# Altium schematic sheet OPA41971.V03.R00.SchDoc: Conversión a DAC Bipolar
size A4; SheetNumber: 12; SheetTotal: 18
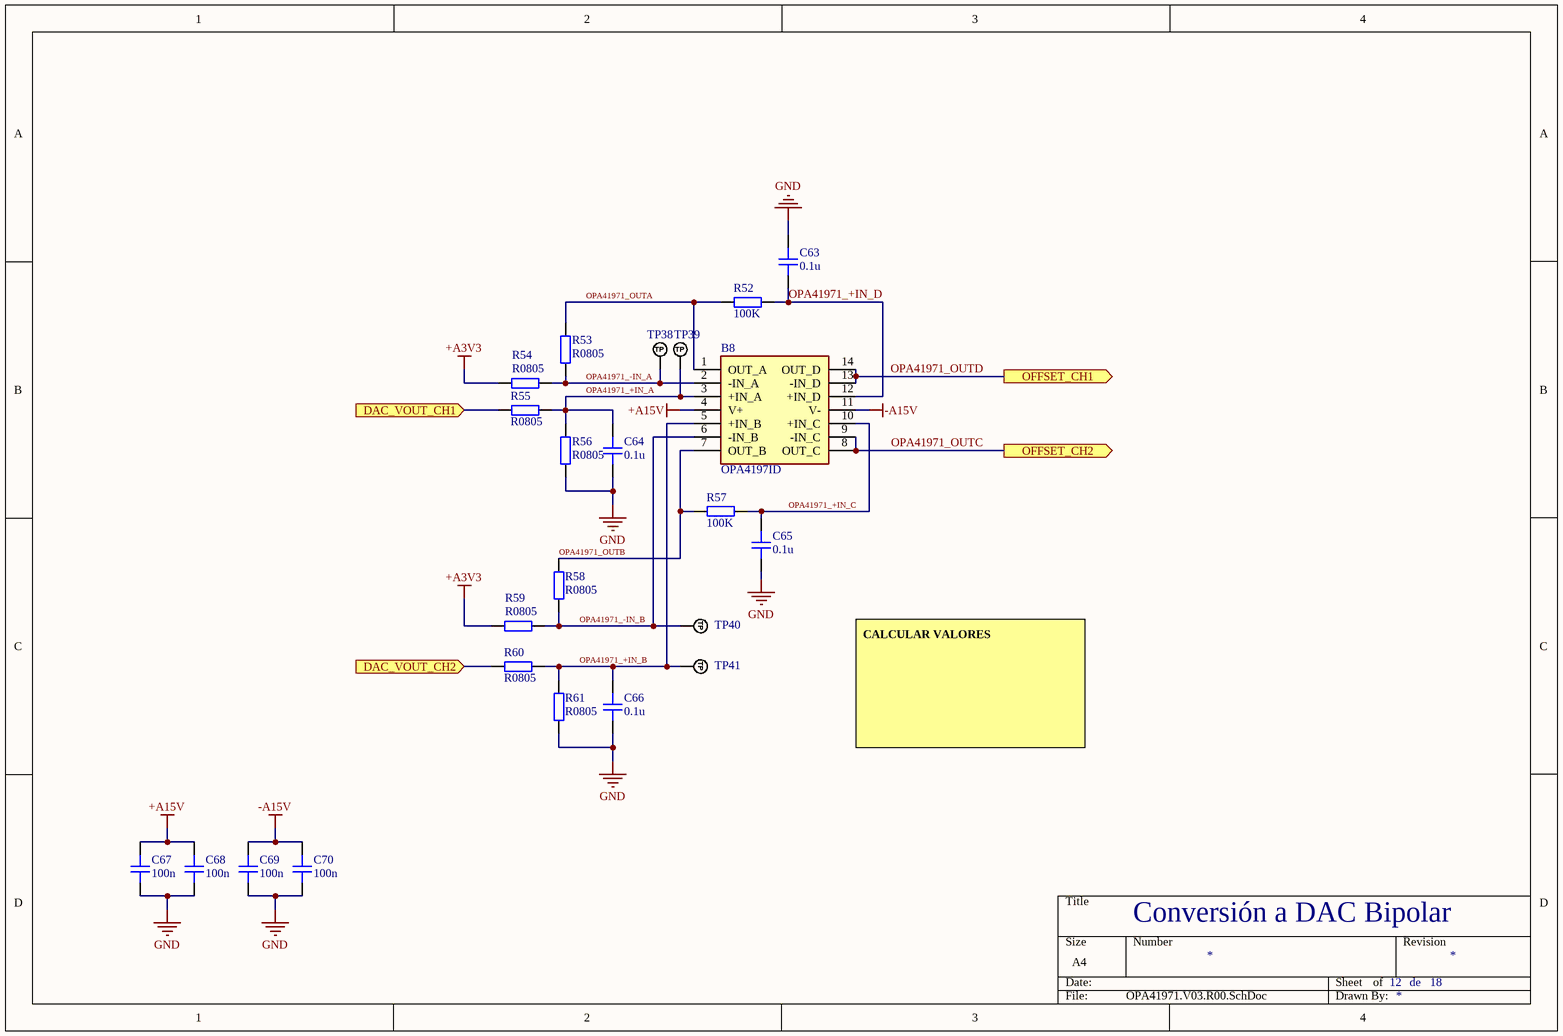
[diagram p0: OPA41971.V03.R00.SchDoc]

## Parts
B8  OPA4197ID  [SOIC127P600X175-14N]
C63  0.1u  [CAP_0805]
C64  0.1u  [CAP_0805]
C65  0.1u  [CAP_0805]
C66  0.1u  [CAP_0805]
C67  100n  [CAP_0805]
C68  100n  [CAP_0805]
C69  100n  [CAP_0805]
C70  100n  [CAP_0805]
R52  100K  [RES_0805]
R53  R0805  [RES_0805]
R54  R0805  [RES_0805]
R55  R0805  [RES_0805]
R56  R0805  [RES_0805]
R57  100K  [RES_0805]
R58  R0805  [RES_0805]
R59  R0805  [RES_0805]
R60  R0805  [RES_0805]
R61  R0805  [RES_0805]
TP38  TP_NOBOM  [PAD_RND_1MM]  (value not drawn)  (no BOM)
TP39  TP_NOBOM  [PAD_RND_1MM]  (value not drawn)  (no BOM)
TP40  TP_NOBOM  [PAD_RND_1MM]  (value not drawn)  (no BOM)
TP41  TP_NOBOM  [PAD_RND_1MM]  (value not drawn)  (no BOM)

## Ports
DAC_VOUT_CH1 (in), DAC_VOUT_CH2 (in), OFFSET_CH1 (out), OFFSET_CH2 (out)

## Nets
+A3V3: R54.1 R59.1
+A15V: B8.4(V+) C67.2 C68.2
-A15V: B8.11(V-) C69.2 C70.2
GND: C63.2 C64.1 C65.1 C66.1 C67.1 C68.1 C69.1 C70.1 R56.1 R61.1
DAC_VOUT_CH1: R55.1 ; port DAC_VOUT_CH1
DAC_VOUT_CH2: R60.1 ; port DAC_VOUT_CH2
OPA41971_+IN_A: B8.3(+IN_A) C64.2 R55.2 R56.2 TP39.1(TP)
OPA41971_+IN_B: B8.5(+IN_B) C66.2 R60.2 R61.2 TP41.1(TP)
OPA41971_+IN_C: B8.10(+IN_C) C65.2 R57.2
OPA41971_+IN_D: B8.12(+IN_D) C63.1 R52.2
OPA41971_-IN_A: B8.2(-IN_A) R53.1 R54.2 TP38.1(TP)
OPA41971_-IN_B: B8.6(-IN_B) R58.1 R59.2 TP40.1(TP)
OPA41971_OUTA: B8.1(OUT_A) R52.1 R53.2
OPA41971_OUTB: B8.7(OUT_B) R57.1 R58.2
OPA41971_OUTC: B8.8(OUT_C) B8.9(-IN_C) ; port OFFSET_CH2
OPA41971_OUTD: B8.13(-IN_D) B8.14(OUT_D) ; port OFFSET_CH1

## Notes on the sheet
- CALCULAR VALORES
- de

## Library data of the parts
B8 = OPA4197ID: 36-V, Precision, Rail-to-Rail Input Output, Low Offset Voltage Op Amp; Manufacturer_Name: Texas Instruments; Geometry.Height: 1.75mm; Mouser Part Number: 595-OPA4197ID; Mouser Price/Stock: https://www.mouser.co.uk/ProductDetail/Texas-Instruments/OPA4197ID?qs=LuYMPh7GGMRrQsevs5FGag%3D%3D; Manufacturer_Part_Number: OPA4197ID; Datasheet Link: http://www.ti.com/lit/gpn/OPA4197
C63-C70 = CAP_0805: Capacitor SMD 0805; Manufacturer: *; Manufacturer Part Number: *; Distributor Link: *; LCSC: *; Rating: *; Dielectric: *
R52-R61 = RES_0805: Resistor SMD 0805; Manufacturer: *; Manufacturer Part Number: *; Distributor Link: *; LCSC: *
TP38-TP41 = TEST_POINT_RND_1MM: Test Point Round 1mm (NO BOM)